# Altium project EIT.PrjPcb
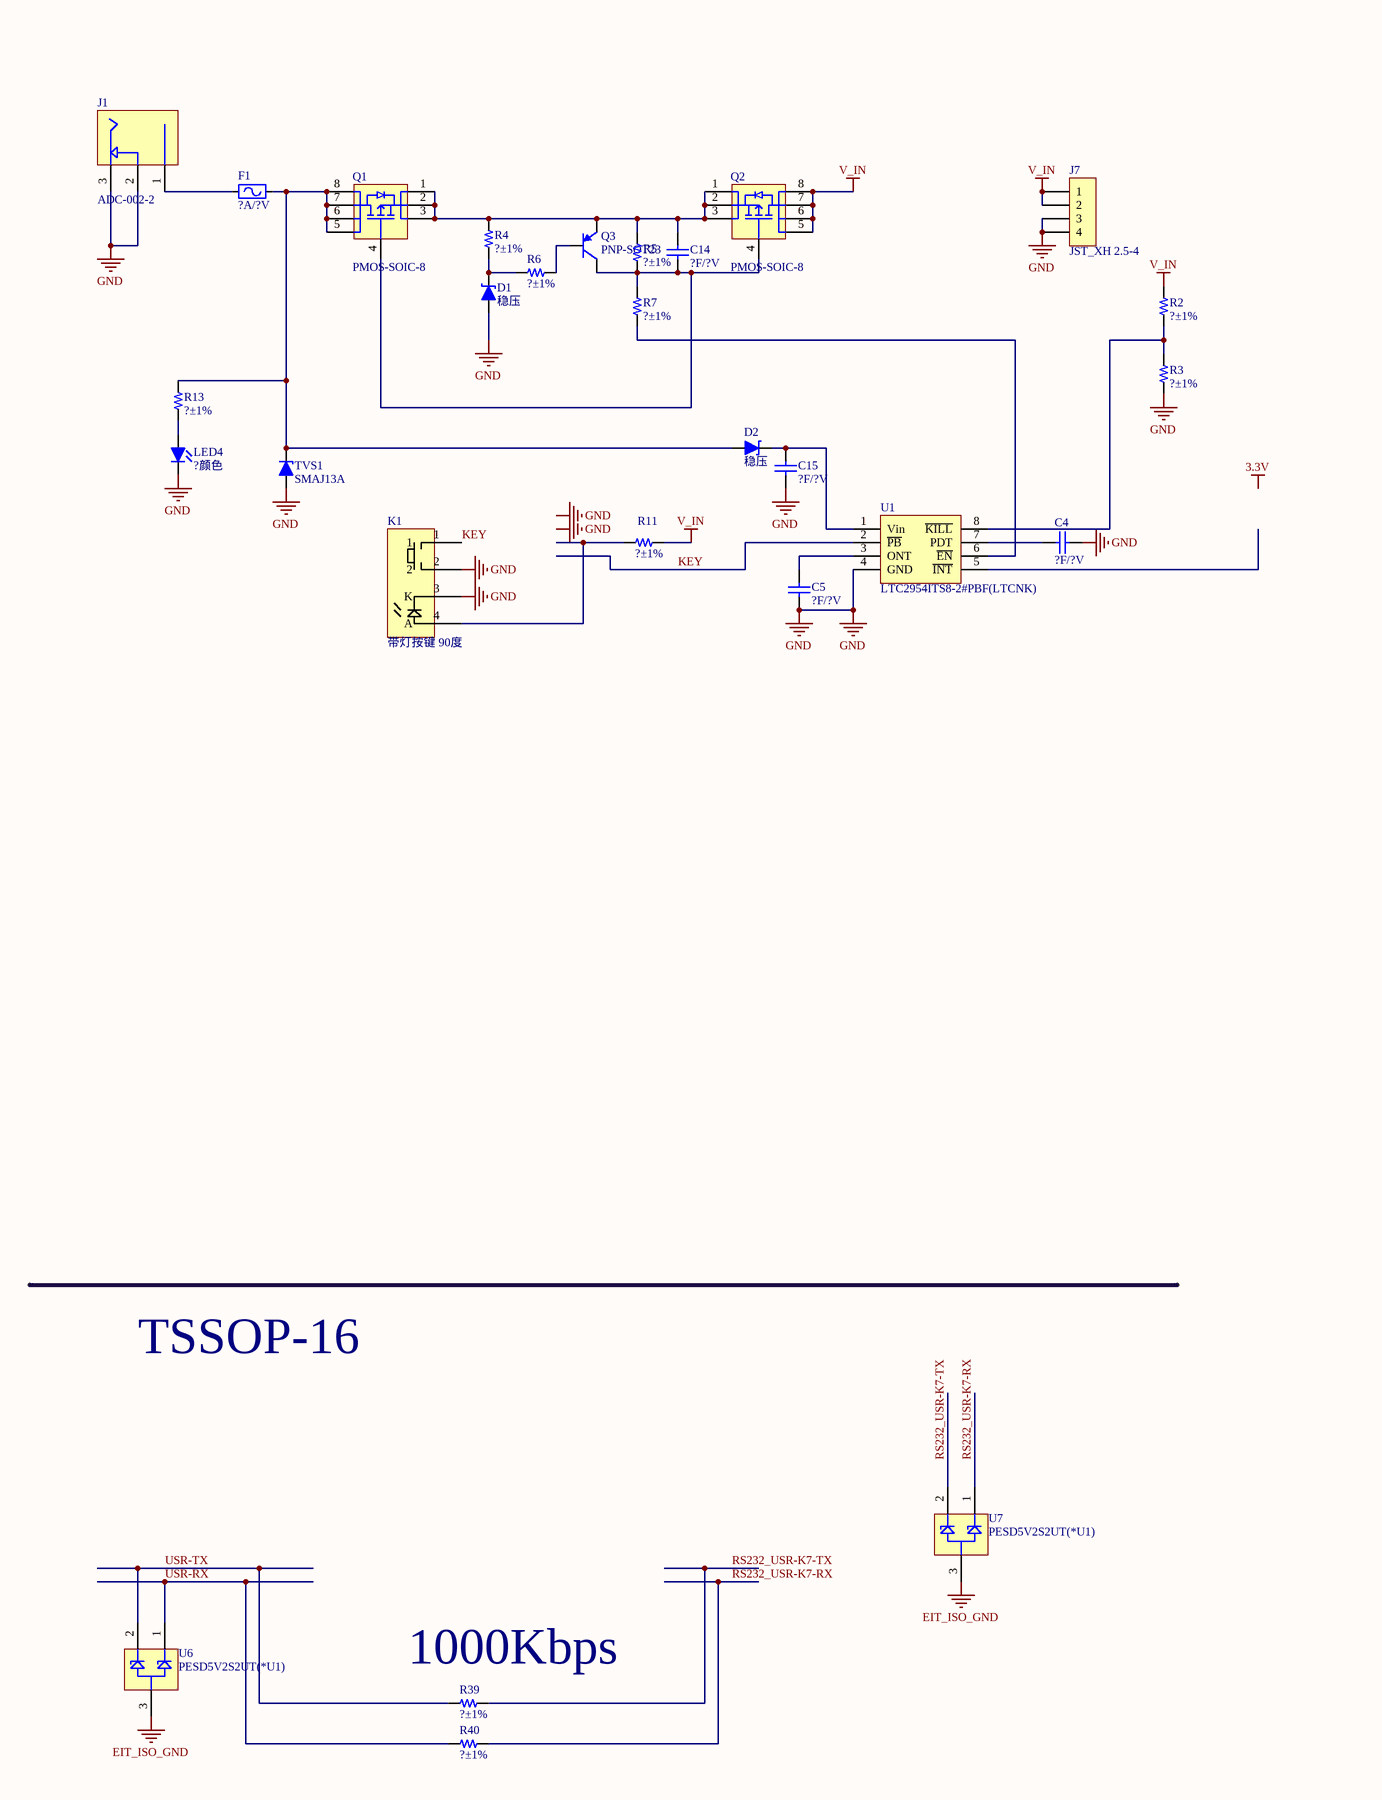
[diagram p0: EIT 串口转LAN.SchDoc, left]
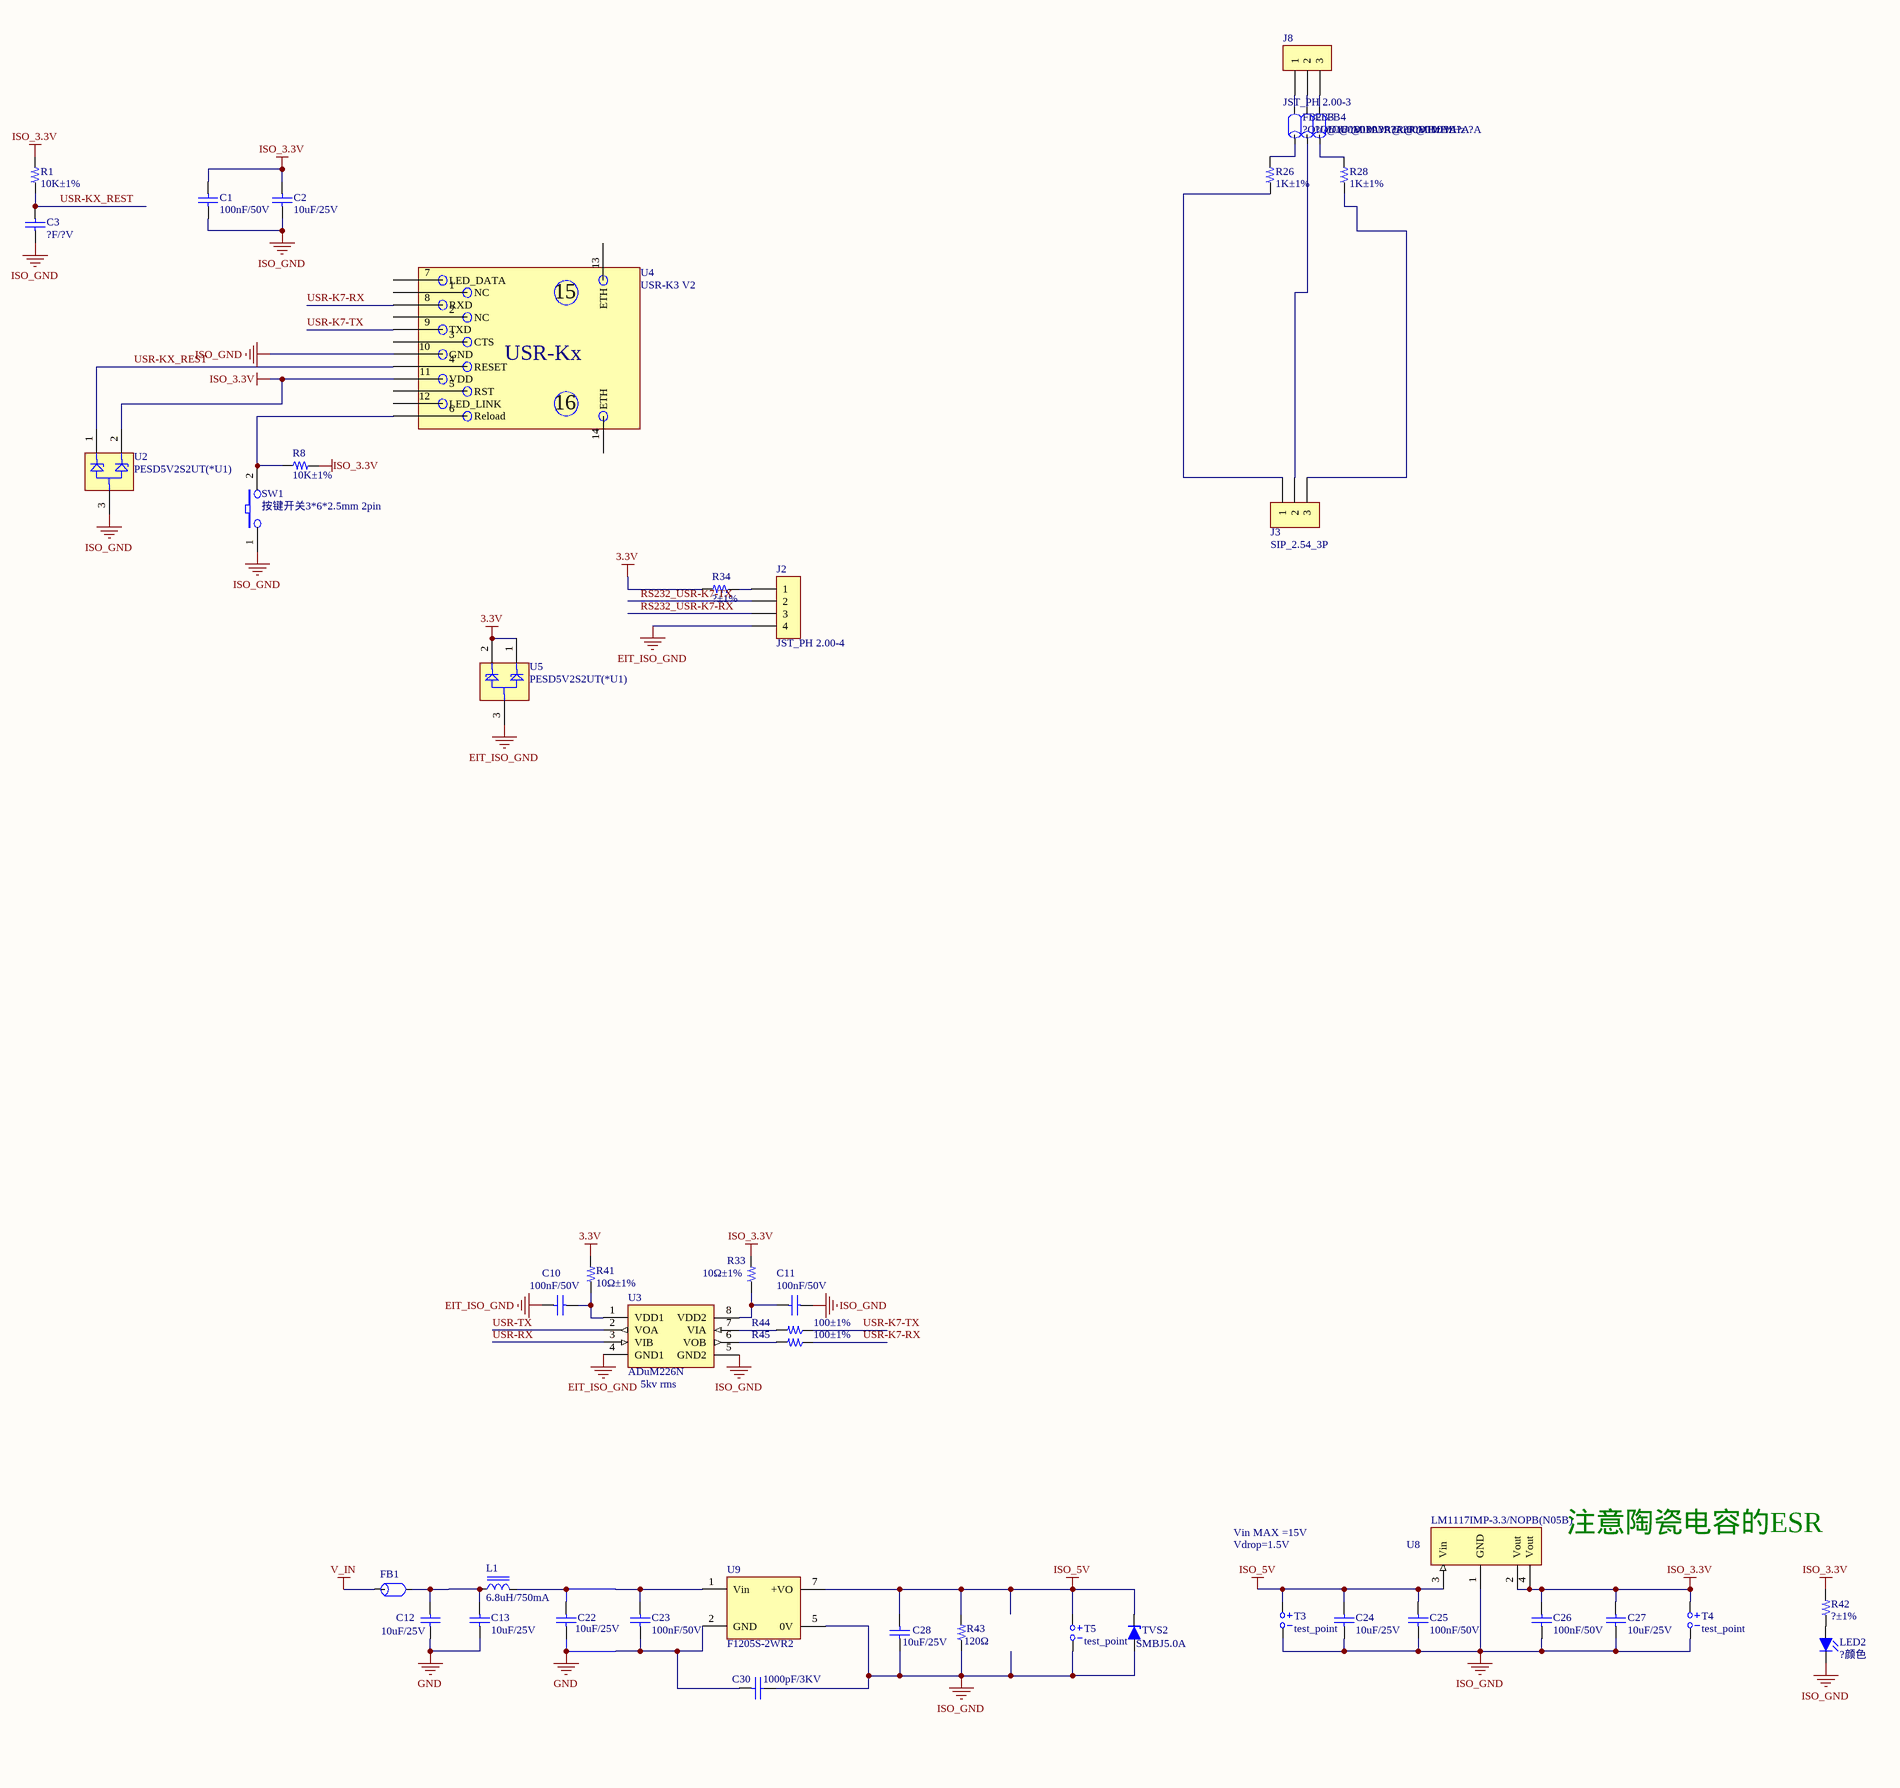
[diagram p1: EIT 串口转LAN.SchDoc, right]
1 sheet, 74 parts. Net scope: global (net labels, ports and power ports of the same name join across sheets).
Board file: PCB1.PcbDoc

## Sheet EIT 串口转LAN.SchDoc
size A1

### Parts
C1  100nF/50V  [C-0603]
C2  10uF/25V  [C-1206]
C3  ?F/?V  [C-0603]
C4  ?F/?V  [C-0805]
C5  ?F/?V  [C-0805]
C10  100nF/50V  [C-0603]
C11  100nF/50V  [C-0603]
C12  10uF/25V  [C-1210]
C13  10uF/25V  [C-1210]
C14  ?F/?V  [C-0603]
C15  ?F/?V  [C-0805]
C22  10uF/25V  [C-1210]
C23  100nF/50V  [C-0603]
C24  10uF/25V  [C-1206]
C25  100nF/50V  [C-0603]
C26  100nF/50V  [C-0603]
C27  10uF/25V  [C-1206]
C28  10uF/25V  [C-1210]
C30  1000pF/3KV  [HV_CAP]
D1  稳压  [DO-213AB/LL34/MiniMELF]
D2  稳压  [DO-214AC/SMA]
F1  ?A/?V  [F-Littlefuse_154]
FB1  贴片磁珠600R@100MHz,2500mA,1206  [FB-1206]  (value not drawn)
FB2  ?OU/@100M ?A?R@100MHz ?A  [FB-0805]
FB3  ?OU/@100M ?A?R@100MHz ?A  [FB-0805]
FB4  ?OU/@100M ?A?R@100MHz ?A  [FB-0805]
J1  ADC-002-2  [ADC-002-2]
J2  JST_PH 2.00-4  [JST_PH 2.00-4]
J3  SIP_2.54_3P  [SIP_2.54_3P]
J7  JST_XH 2.5-4  [JST_XH 2.5-4]
J8  JST_PH 2.00-3  [JST_PH 2.00-3]
K1  带灯按键 90度  [带灯按键 90度]
L1  6.8uH/750mA  [L-WE-TPC Size 3816]
LED2  ?颜色  [LED-0805]
LED4  ?颜色  [LED-0805]
Q1  PMOS-SOIC-8  [SOIC-8(4.90*3.9)]
Q2  PMOS-SOIC-8  [SOIC-8(4.90*3.9)]
Q3  PNP-SOT23  [SOT23-3]
R1  10K±1%  [R-0805]
R2  ?±1%  [R-0603]
R3  ?±1%  [R-0603]
R4  ?±1%  [R-0603]
R5  ?±1%  [R-0603]
R6  ?±1%  [R-0603]
R7  ?±1%  [R-0603]
R8  10K±1%  [R-0805]
R11  ?±1%  [R-1206]
R13  ?±1%  [R-0603]
R26  1K±1%  [R-0603]
R28  1K±1%  [R-0603]
R33  10Ω±1%  [R-0805]
R34  ?±1%  [R-0805]
R39  ?±1%  [R-0603]
R40  ?±1%  [R-0603]
R41  10Ω±1%  [R-0805]
R42  ?±1%  [R-0603]
R43  120Ω  [R-2512]
R44  100±1%  [R-0603]
R45  100±1%  [R-0603]
SW1  按键开关3*6*2.5mm 2pin  [按键开关3*6*2.5mm 2pin]
T3  test_point  [TP-DIP-2]
T4  test_point  [TP-DIP-2]
T5  test_point  [TP-DIP-2]
TVS1  SMAJ13A  [DO-214AC/SMA]
TVS2  SMBJ5.0A  [DO-214AA/SMB]
U1  LTC2954ITS8-2#PBF(LTCNK)  [SOT23-8]
U2  PESD5V2S2UT(*U1)  [SOT23-3]
U3  ADuM226N  [SOIC-8(Wide Body)]
U4  USR-K3 V2
U5  PESD5V2S2UT(*U1)  [SOT23-3]
U6  PESD5V2S2UT(*U1)  [SOT23-3]
U7  PESD5V2S2UT(*U1)  [SOT23-3]
U8  LM1117IMP-3.3/NOPB(N05B)  [SOT223]
U9  F1205S-2WR2  [F_S-2WR2]

### Nets
3.3V: R34.1 R41.2 U5.1 U5.2
EIT_ISO_GND: C10.2 J2.4 U3.4(GND1) U5.3 U6.3 U7.3
GND: C4.2 C5.1 C12.1 C13.1 C15.1 C22.1 C23.2 C30.1 D1.A J1.2 J1.3 J7.3 J7.4 K1.2 K1.3(K) LED4.K R3.1 TVS1.A U1.4(GND) U9.2(GND)
ISO_3.3V: C1.2 C2.2 C26.2 C27.2 R1.2 R8.2 R33.2 R42.2 T4.1(+) U2.2 U4.11(VDD) U8.2(Vout) U8.4(Vout)
ISO_5V: C24.2 C25.2 C28.2 R43.2(BOT) T3.1(+) T5.1(+) TVS2.K U8.3(Vin) U9.7(+VO)
ISO_GND: C1.1 C2.1 C3.2 C11.1 C24.1 C25.1 C26.1 C27.1 C28.1 C30.2 LED2.K R43.1(TOP) SW1.1 T3.2(-) T4.2(-) T5.2(-) TVS2.A U2.3 U3.5(GND2) U4.10(GND) U8.1(GND) U9.5(0V)
V_IN: FB1.1 J7.1 J7.2 Q2.5(D) Q2.6(D) Q2.7(D) Q2.8(D) R2.2 R11.2
KEY: K1.1 U1.2(~{PB})
RS232_USR-K7-RX: J2.3 R40.2 U7.1
RS232_USR-K7-TX: J2.2 R39.2 U7.2
USR-K7-RX: R45.1 U4.8(RXD)
USR-K7-TX: R44.1 U4.9(TXD)
USR-KX_REST: C3.1 R1.1 U2.1 U4.4(RESET)
USR-RX: R40.1 U3.3(VIB) U6.1
USR-TX: R39.1 U3.2(VOA) U6.2
NetC4_1: C4.1 U1.7(PDT)
NetC5_2: C5.2 U1.3(ONT)
NetC10_1: C10.1 R41.1 U3.1(VDD1)
NetC11_2: C11.2 R33.1 U3.8(VDD2)
NetC12_2: C12.2 C13.2 FB1.2 L1.1
NetC14_1: C14.1 Q1.1(S) Q1.2(S) Q1.3(S) Q2.1(S) Q2.2(S) Q2.3(S) Q3.2(E) R4.2 R5.2
NetC14_2: C14.2 Q1.4(G) Q2.4(G) Q3.3(C) R5.1 R7.2
NetC15_2: C15.2 D2.K U1.1(Vin)
NetC22_2: C22.2 C23.1 L1.2 U9.1(Vin)
NetD1_K: D1.K R4.1 R6.2
NetD2_A: D2.A F1.1 Q1.5(D) Q1.6(D) Q1.7(D) Q1.8(D) R13.2 TVS1.K
NetF1_2: F1.2 J1.1
NetFB2_1: FB2.1 R26.2
NetFB2_2: FB2.2 J8.1
NetFB3_1: FB3.1 J3.2
NetFB3_2: FB3.2 J8.2
NetFB4_1: FB4.1 R28.2
NetFB4_2: FB4.2 J8.3
NetJ2_1: J2.1 R34.2
NetJ3_1: J3.1 R26.1
NetJ3_3: J3.3 R28.1
NetK1_4: K1.4(A) R11.1
NetLED2_A: LED2.A R42.1
NetLED4_A: LED4.A R13.1
NetQ3_1: Q3.1(B) R6.1
NetR2_1: R2.1 R3.2 U1.8(~{KILL})
NetR7_1: R7.1 U1.6(~{EN})
NetR8_1: R8.1 SW1.2 U4.6(Reload)
NetR44_2: R44.2 U3.7(VIA)
NetR45_2: R45.2 U3.6(VOB)

Not connected (* = marked no-connect by the designer): U1 5(~{INT}); U4 1(NC) 2(NC) 3(CTS) 5(RST) 7(LED_DATA) 12(LED_LINK) 13(ETH) 14(ETH)

### Notes on the sheet
- TSSOP-16
- (near U3) 5kv rms
- Vin MAX =15V
- Vdrop=1.5V
- (near U8) 注意陶瓷电容的ESR
- (near R39) 1000Kbps
- Labels drawn without touching a wire or pin: 3.3V, GND
- (in symbol USR-K3 V2) 15; USR-Kx; 16

### Library data of the parts
C1 C3 C10 C11 C14 C23 C25 C26 = C-0603: 物料编号: *; 物料名称: *; 厂家: *; 详细描述: *
C2 C24 C27 = C-1206
C4 C5 C15 = C-0805
C12 C13 C22 C28 = C-1210
C30 = CAP: 品牌：VISHAY(威世)，型号：S102K43X7RR6###R , 径向引线, X7R，ROHS
D1 = Diode-稳压-213AB/LL34/MiniMELF: 厂家: *; 物料名称: *; 物料编号: *; 详细描述: *
D2 = Diode- 稳压-214AC (SMA): 版本: V1.00; 物料编号: APLLY; 详细描述: 贴片，二极管
F1 = F-Littlefuse_154: 厂家: Littlefuse; 物料编号: *; 详细描述: *
FB1 = FB-1206: 品牌:Wurth品牌:Wurth，型号: 742792118, Rdc=0.07ohm，size 1206,2500mA，符合ROHS。
FB2-FB4 = FB-0805
J1 = ADC-002-2: 名称: 接插件; 详细描述: 12 V 1 A 2.5 mm Center Pin PCB Mount DC Power Jack; 制造商: Adam Technology
J2 = JST_PH 2.00-4: 品牌：JST 型号：B4B-PH-K-S，直插，间距2.00，4pin; 名称: 插座2针，2.0间距; 制造商: JST
J3 = SIP_2.54_3P: 名称: 接插件; 详细描述: 直插，间距2.54，2pin
J7 = JST_XH 2.5-4: 品牌：JST 型号：B4B-XH-A，直插，间距2.5，4pin; 名称: 插座2针，2.0间距; 制造商: JST
J8 = JST_PH 2.00-3: 品牌：JST 型号：B3B-PH-K-S，直插，间距2.00，3pin; 名称: 插座2针，2.0间距; 制造商: JST
K1 = POWER_BUTTON
L1 = L-WE-TPC Size 3816
LED2 LED4 = LED-0805
Q1 Q2 = PMOS-SOIC-8: 品牌：型号：
Q3 = PNP-SOT23: 品牌：型号：
R1 R8 R33 R34 R41 = R-0805
R2-R7 R13 R26 R28 R39 R40 R42 R44 R45 = R-0603
R11 = R-1206
R43 = 3Ω_1: 国巨RC2512FK-073R; 物料编号: 210002441; 详细描述: 2512,1W,国巨RC2512FK-073R; 制造商: 国巨; 版本: V1.00; 名称: 贴片电阻3±1%
SW1 = 按键开关3*6*2.5mm 2pin: 厂家: 欧姆龙; 物料名称: 按键; 物料编号: *; 详细描述: *
T3-T5 = TP-DIP-2
TVS1 = TVS-Diode-214AC/SMA
TVS2 = TVS-Diode-214AA/SMB
U1 = LTC2954ITS8-2#PBF: Linear,LTC2954ITS8-2#PBF,TSOT-23,–40~+85°C,; 名称: 电源管理芯片LTC2954ITS8-2#PBF; 制造商: Linear
U2 U5-U7 = PESD5V2S2UT: 品牌：NXP，型号：PESD5V2S2UT，SOT23-3，ROHS; 制造商: Philips; 名称: ESD保护PESD5V2S2UT; 详细描述: Philips,PESD5V2S2UT,SOT23-3,
U3 = ADuM226N: 品牌：ADI，型号：ADuM226N0BRIZ,SOIC-8,-40~+105°C,ROHS
U8 = LM1117IMP-3.3/NOPB: 品牌：TI，型号：LM1117IMP-3.3/NOPB，800-mA Low-Dropout，SOT223，-40~+ 125°C，ROHS
U9 = F_S-2WR2: 品牌：金升阳，型号：，3000VDC隔离，输出2W